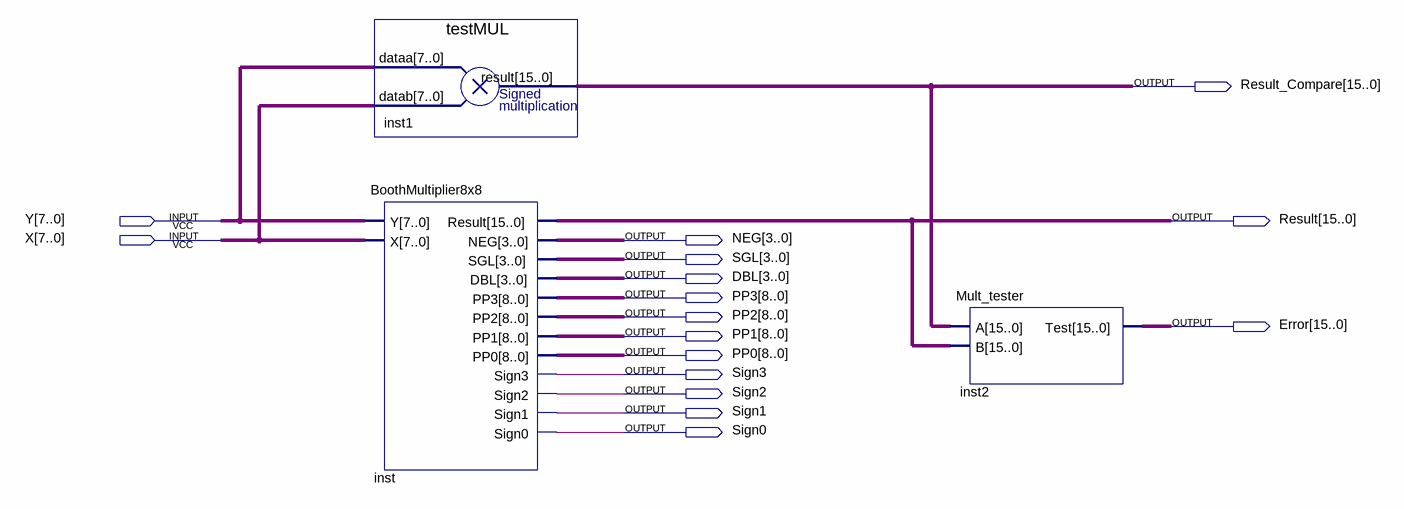
[diagram p0: schematic sheet]
// Quartus schematic DUT.bdf as structural Verilog: 3 symbols, 16 pins
module DUT (
  input  [7:0] Y,
  input  [7:0] X,
  output [15:0] Result_Compare,
  output [15:0] Result,
  output [3:0] NEG,
  output [3:0] SGL,
  output [3:0] DBL,
  output [8:0] PP3,
  output [8:0] PP2,
  output [15:0] Error,
  output [8:0] PP1,
  output [8:0] PP0,
  output Sign3,
  output Sign2,
  output Sign1,
  output Sign0
);

  testMUL inst1 (.dataa(Y), .datab(X), .result(Result_Compare));
  BoothMultiplier8x8 inst (
    .Y(Y), .X(X), .Result(Result), .NEG(NEG), .SGL(SGL), .DBL(DBL), .PP3(PP3), .PP2(PP2), .PP1(PP1),
    .PP0(PP0), .Sign3(Sign3), .Sign2(Sign2), .Sign1(Sign1), .Sign0(Sign0));
  Mult_tester inst2 (.A(Result_Compare), .B(Result), .Test(Error));
endmodule
